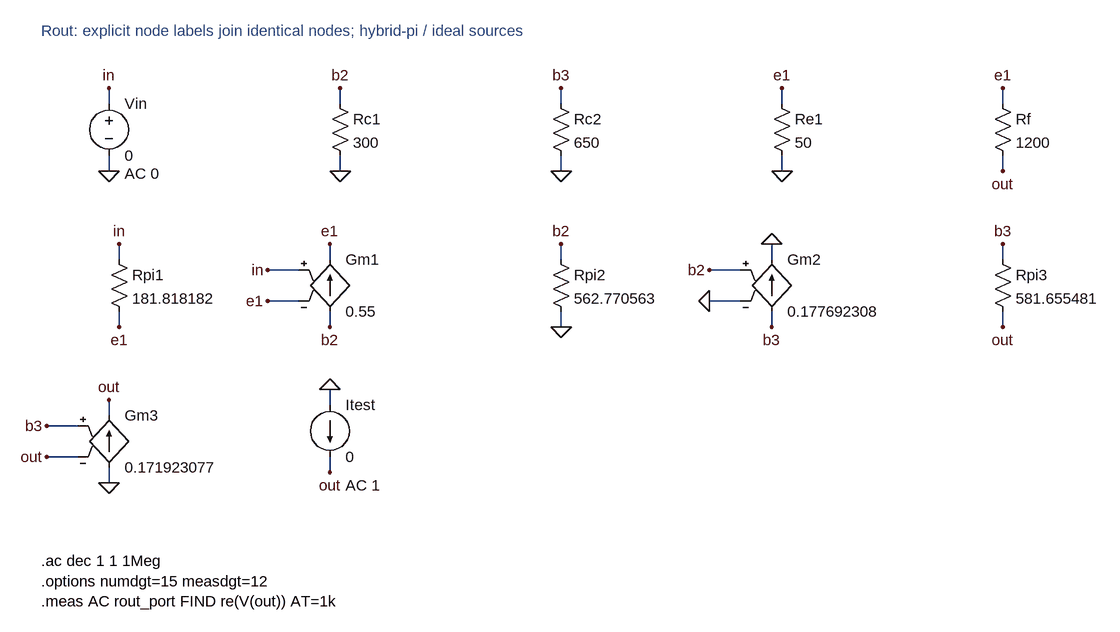
[diagram p0: schematic Rout.asc]
Rout.asc, the LTspice schematic file:
Version 4
SHEET 1 1800 1500
TEXT 16 -48 Left 2 ;Rout: explicit node labels join identical nodes; hybrid-pi / ideal sources
WIRE 120 64 120 40
FLAG 120 40 in
WIRE 120 144 120 168
FLAG 120 168 0
SYMBOL voltage 120 48 R0
SYMATTR InstName Vin
WINDOW 123 24 124 Left 2
SYMATTR Value 0
SYMATTR Value2 AC 0
WIRE 476 64 476 40
FLAG 476 40 b2
WIRE 476 144 476 168
FLAG 476 168 0
SYMBOL res 460 48 R0
SYMATTR InstName Rc1
SYMATTR Value 300
WIRE 816 64 816 40
FLAG 816 40 b3
WIRE 816 144 816 168
FLAG 816 168 0
SYMBOL res 800 48 R0
SYMATTR InstName Rc2
SYMATTR Value 650
WIRE 1156 64 1156 40
FLAG 1156 40 e1
WIRE 1156 144 1156 168
FLAG 1156 168 0
SYMBOL res 1140 48 R0
SYMATTR InstName Re1
SYMATTR Value 50
WIRE 1496 64 1496 40
FLAG 1496 40 e1
WIRE 1496 144 1496 168
FLAG 1496 168 out
SYMBOL res 1480 48 R0
SYMATTR InstName Rf
SYMATTR Value 1200
WIRE 136 304 136 280
FLAG 136 280 in
WIRE 136 384 136 408
FLAG 136 408 e1
SYMBOL res 120 288 R0
SYMATTR InstName Rpi1
SYMATTR Value 181.818182
WIRE 460 384 460 408
FLAG 460 408 b2
WIRE 460 304 460 280
FLAG 460 280 e1
WIRE 412 320 364 320
FLAG 364 320 in
WIRE 412 368 364 368
FLAG 364 368 e1
SYMBOL g 460 288 R0
SYMATTR InstName Gm1
SYMATTR Value 0.55
WIRE 816 304 816 280
FLAG 816 280 b2
WIRE 816 384 816 408
FLAG 816 408 0
SYMBOL res 800 288 R0
SYMATTR InstName Rpi2
SYMATTR Value 562.770563
WIRE 1140 384 1140 408
FLAG 1140 408 b3
WIRE 1140 304 1140 280
FLAG 1140 280 0
WIRE 1092 320 1044 320
FLAG 1044 320 b2
WIRE 1092 368 1044 368
FLAG 1044 368 0
SYMBOL g 1140 288 R0
SYMATTR InstName Gm2
SYMATTR Value 0.177692308
WIRE 1496 304 1496 280
FLAG 1496 280 b3
WIRE 1496 384 1496 408
FLAG 1496 408 out
SYMBOL res 1480 288 R0
SYMATTR InstName Rpi3
SYMATTR Value 581.655481
WIRE 120 624 120 648
FLAG 120 648 0
WIRE 120 544 120 520
FLAG 120 520 out
WIRE 72 560 24 560
FLAG 24 560 b3
WIRE 72 608 24 608
FLAG 24 608 out
SYMBOL g 120 528 R0
SYMATTR InstName Gm3
SYMATTR Value 0.171923077
WIRE 460 528 460 504
FLAG 460 504 0
WIRE 460 608 460 632
FLAG 460 632 out
SYMBOL current 460 528 R0
SYMATTR InstName Itest
WINDOW 123 24 124 Left 2
SYMATTR Value 0
SYMATTR Value2 AC 1
TEXT 16 768 Left 2 !.ac dec 1 1 1Meg\n.options numdgt=15 measdgt=12\n.meas AC rout_port FIND re(V(out)) AT=1k

The netlist it stands for:
* Rout.asc
Vin in 0 0 AC 0
Rc1 b2 0 300
Rc2 b3 0 650
Re1 e1 0 50
Rf e1 out 1200
Rpi1 in e1 181.818182
Gm1 b2 e1 in e1 0.55
Rpi2 b2 0 562.770563
Gm2 b3 0 b2 0 0.177692308
Rpi3 b3 out 581.655481
Gm3 0 out b3 out 0.171923077
Itest 0 out 0 AC 1
* Rout: explicit node labels join identical nodes; hybrid-pi / ideal sources
.ac dec 1 1 1Meg
.options numdgt=15 measdgt=12
.meas AC rout_port FIND re(V(out)) AT=1k
.backanno
.end

* Results of the author's LTspice run, read from the files saved beside the schematic
* From the log:
*   rout_port: re(V(out))=(-3.84450739656dB,0°) at 1000